# Altium project 海关全向控制器图传转接板.PrjPcb
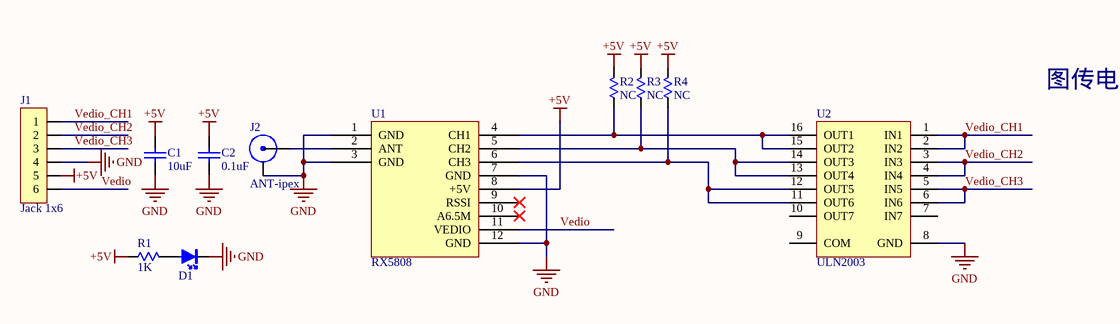
[diagram p0: 海关全向控制器图传转接板.SchDoc]
1 sheet, 11 parts. Net scope: global (net labels, ports and power ports of the same name join across sheets).
Board file: 海关全向控制器图传转接板.PcbDoc

## Sheet 海关全向控制器图传转接板.SchDoc
size A4

### Parts
C1  10uF  [C0603]
C2  0.1uF  [C0603]
D1  LED  [LED0603]  (value not drawn)
J1  Jack 1x6  [ZH-6AWD]
J2  ANT-ipex  [IPEX]
R1  1K  [R0603]
R2  NC  [R0603]
R3  NC  [R0603]
R4  NC  [R0603]
U1  RX5808  [RX5808]
U2  ULN2003  [SO16]

### Nets
+5V: C1.2 C2.2 J1.5 R1.1 R2.2 R3.2 R4.2 U1.8(+5V)
GND: C1.1 C2.1 D1.2(K) J1.4 J2.2(GND) U1.1(GND) U1.3(GND) U1.7(GND) U1.12(GND) U2.8(GND)
Vedio: J1.6 U1.11(VEDIO)
Vedio_CH1: J1.1 U2.1(IN1) U2.2(IN2)
Vedio_CH2: J1.2 U2.3(IN3) U2.4(IN4)
Vedio_CH3: J1.3 U2.5(IN5) U2.6(IN6)
NetD1_1: D1.1(A) R1.2
NetJ2_1: J2.1(ANT) U1.2(ANT)
NetR2_1: R2.1 U1.4(CH1) U2.15(OUT2) U2.16(OUT1)
NetR3_1: R3.1 U1.5(CH2) U2.13(OUT4) U2.14(OUT3)
NetR4_1: R4.1 U1.6(CH3) U2.11(OUT6) U2.12(OUT5)

Not connected (* = marked no-connect by the designer): U1 9(RSSI)* 10(A6.5M)*; U2 7(IN7) 9(COM) 10(OUT7)

### Notes on the sheet
- 图传电路

### Library data of the parts
C1 C2 = Cap Semi
J1 = Jack 1x6: 插座
R1-R4 = Res: Resistor; Published: 8-Jun-2000; LatestRevisionDate: 04-Mar-2005; LatestRevisionNote: PCB Footprint replaced.; PackageReference: J1-0603; Publisher: Altium Limited